# EAGLE schematic hbs_pcb (EAGLE 9.3.2)
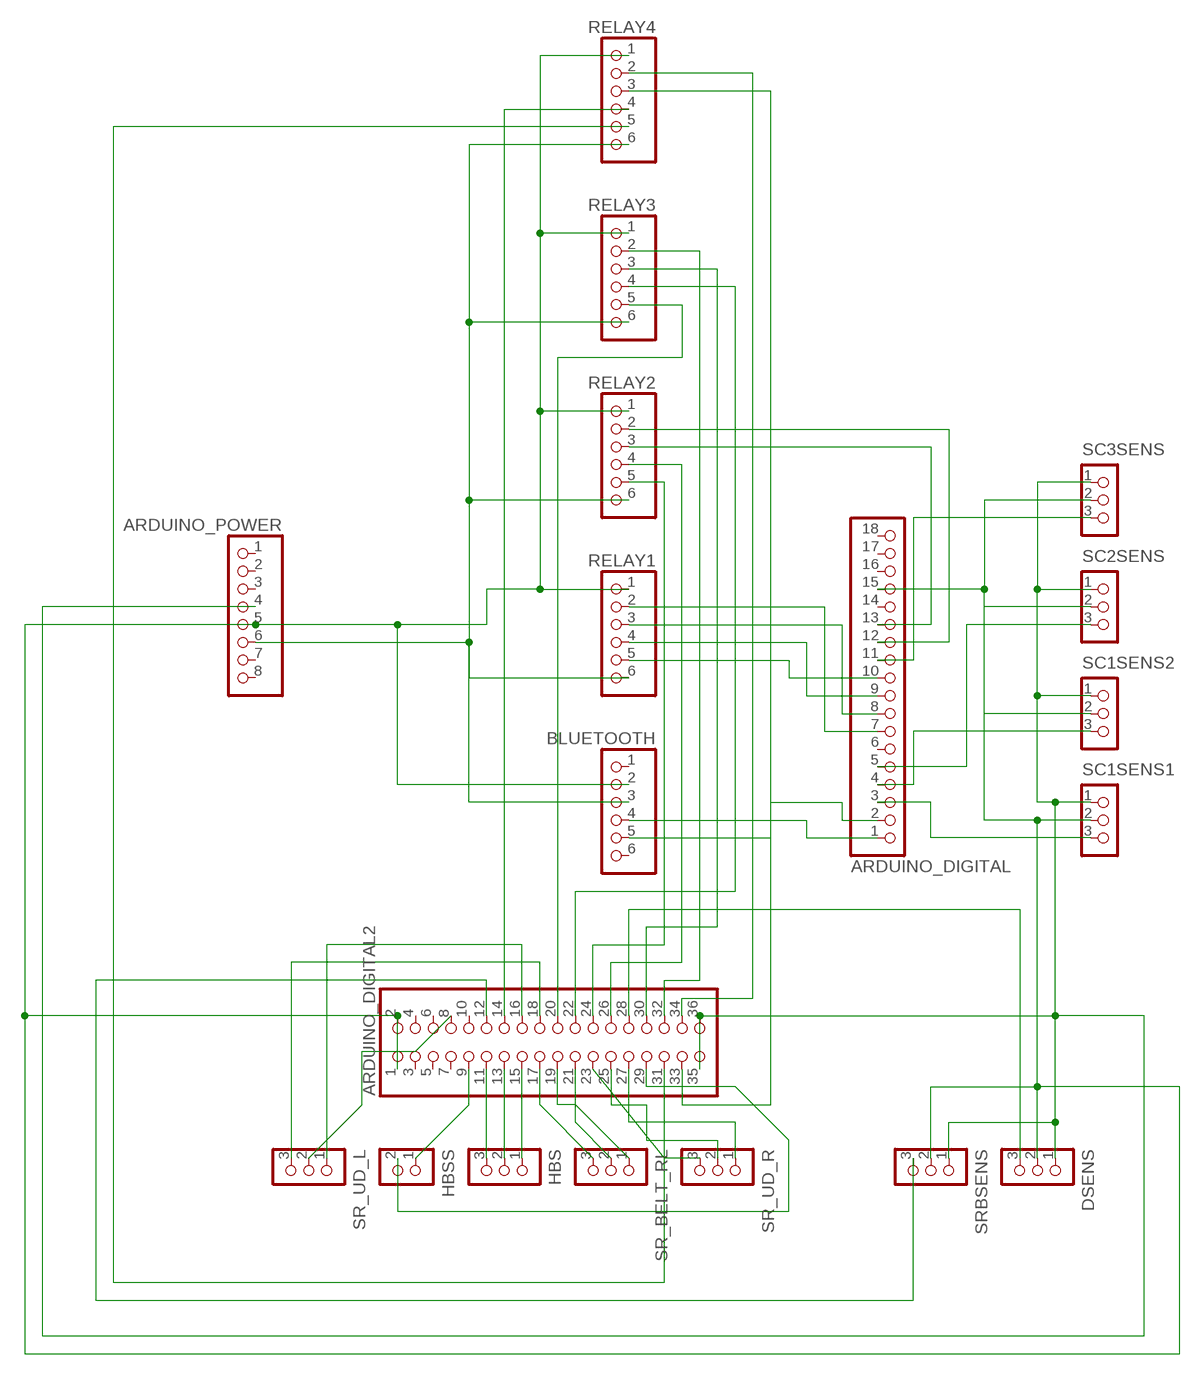
[diagram p0: schematic, sheet 1]

## Parts
ARDUINO_DIGITAL  PINHD-1X18  [1X18]
ARDUINO_DIGITAL2  PINHD-2X18  [2X18]
ARDUINO_POWER  PINHD-1X8  [1X08]
BLUETOOTH  PINHD-1X6  [1X06]
DSENS  CON_TERMINAL_BLOCK_03-5MM  [TERMINAL_BLOCK_3P_5]
HBS  CON_TERMINAL_BLOCK_03-5MM  [TERMINAL_BLOCK_3P_5]
HBSS  CON_TERMINAL_BLOCK_02-5MM  [TERMINAL_BLOCK_2P_5]
RELAY1  PINHD-1X6  [1X06]
RELAY2  PINHD-1X6  [1X06]
RELAY3  PINHD-1X6  [1X06]
RELAY4  PINHD-1X6  [1X06]
SC1SENS1  CON_TERMINAL_BLOCK_03-5MM  [TERMINAL_BLOCK_3P_5]
SC1SENS2  CON_TERMINAL_BLOCK_03-5MM  [TERMINAL_BLOCK_3P_5]
SC2SENS  CON_TERMINAL_BLOCK_03-5MM  [TERMINAL_BLOCK_3P_5]
SC3SENS  CON_TERMINAL_BLOCK_03-5MM  [TERMINAL_BLOCK_3P_5]
SR_BELT_RL  CON_TERMINAL_BLOCK_03-5MM  [TERMINAL_BLOCK_3P_5]
SR_UD_L  CON_TERMINAL_BLOCK_03-5MM  [TERMINAL_BLOCK_3P_5]
SR_UD_R  CON_TERMINAL_BLOCK_03-5MM  [TERMINAL_BLOCK_3P_5]
SRBSENS  CON_TERMINAL_BLOCK_03-5MM  [TERMINAL_BLOCK_3P_5]

## Nets
N$1: ARDUINO_DIGITAL.1 BLUETOOTH.4
N$2: ARDUINO_DIGITAL.2 BLUETOOTH.5
N$3: ARDUINO_DIGITAL.3 SC1SENS1.3
N$4: ARDUINO_DIGITAL.4 SC1SENS2.3
N$5: ARDUINO_DIGITAL.5 SC2SENS.3
N$6: ARDUINO_DIGITAL.11 SC3SENS.3
N$7: ARDUINO_DIGITAL.7 RELAY1.2
N$8: ARDUINO_DIGITAL.8 RELAY1.3
N$9: ARDUINO_DIGITAL.9 RELAY1.4
N$10: ARDUINO_DIGITAL.10 RELAY1.5
N$11: ARDUINO_DIGITAL.12 RELAY2.2
N$12: ARDUINO_DIGITAL.13 RELAY2.3
N$14: ARDUINO_DIGITAL2.26 RELAY2.4
N$16: ARDUINO_DIGITAL2.24 RELAY2.5
N$17: ARDUINO_DIGITAL2.32 RELAY3.2
N$18: ARDUINO_DIGITAL2.30 RELAY3.3
N$19: ARDUINO_DIGITAL2.28 DSENS.3
N$20: ARDUINO_DIGITAL2.22 RELAY3.4
N$21: ARDUINO_DIGITAL2.20 RELAY3.5
N$22: ARDUINO_DIGITAL2.34 RELAY4.2
N$23: ARDUINO_DIGITAL2.33 RELAY4.3
N$24: ARDUINO_DIGITAL2.14 RELAY4.4
N$25: ARDUINO_DIGITAL2.31 RELAY4.5
N$27: ARDUINO_POWER.6 BLUETOOTH.3 RELAY1.6 RELAY2.6 RELAY3.6 RELAY4.6
N$28: ARDUINO_DIGITAL2.12 SRBSENS.3
N$29: ARDUINO_DIGITAL2.27 SR_UD_R.1
N$30: ARDUINO_DIGITAL2.25 SR_UD_R.2
N$31: ARDUINO_DIGITAL2.23 SR_UD_R.3
N$32: ARDUINO_DIGITAL2.21 SR_BELT_RL.2
N$33: ARDUINO_DIGITAL2.19 SR_BELT_RL.1
N$34: ARDUINO_DIGITAL2.17 SR_BELT_RL.3
N$35: ARDUINO_DIGITAL2.15 HBS.1
N$36: ARDUINO_DIGITAL2.13 HBS.2
N$37: ARDUINO_DIGITAL2.11 HBS.3
N$38: ARDUINO_DIGITAL2.9 HBSS.1
N$39: ARDUINO_DIGITAL2.29 HBSS.2
N$40: ARDUINO_DIGITAL2.8 SR_UD_L.2
N$41: ARDUINO_DIGITAL2.18 SR_UD_L.3
N$42: ARDUINO_DIGITAL2.16 SR_UD_L.1
N$43: ARDUINO_DIGITAL2.35 ARDUINO_DIGITAL2.36 ARDUINO_POWER.4 DSENS.1 SC1SENS1.1 SC1SENS2.1 SC2SENS.1 SC3SENS.1 SRBSENS.1
N$50: ARDUINO_DIGITAL2.1 ARDUINO_DIGITAL2.2 ARDUINO_DIGITAL.15 ARDUINO_POWER.5 BLUETOOTH.2 DSENS.2 RELAY1.1 RELAY2.1 RELAY3.1 RELAY4.1 SC1SENS1.2 SC1SENS2.2 SC2SENS.2 SC3SENS.2 SRBSENS.2
Unconnected: ARDUINO_DIGITAL2.3 ARDUINO_DIGITAL2.4 ARDUINO_DIGITAL2.5 ARDUINO_DIGITAL2.6 ARDUINO_DIGITAL2.7 ARDUINO_DIGITAL2.10 ARDUINO_DIGITAL.6 ARDUINO_DIGITAL.14 ARDUINO_DIGITAL.16 ARDUINO_DIGITAL.17 ARDUINO_DIGITAL.18 ARDUINO_POWER.1 ARDUINO_POWER.2 ARDUINO_POWER.3 ARDUINO_POWER.7 ARDUINO_POWER.8 BLUETOOTH.1 BLUETOOTH.6

## Library data of the parts
ARDUINO_DIGITAL = pinhead:PINHD-1X18: PIN HEADER
ARDUINO_DIGITAL2 = pinhead:PINHD-2X18: PIN HEADER
ARDUINO_POWER = pinhead:PINHD-1X8: PIN HEADER
BLUETOOTH RELAY1-RELAY4 = pinhead:PINHD-1X6: PIN HEADER
DSENS HBS SC1SENS1 SC1SENS2 SC2SENS SC3SENS SR_BELT_RL SR_UD_L SR_UD_R SRBSENS = dp_devices.v6:CON_TERMINAL_BLOCK_03: 3 poles, wire to board connector
HBSS = dp_devices.v6:CON_TERMINAL_BLOCK_02: 2 poles wire to board terminal block